# EAGLE design mycodo board 1.35 (EAGLE 9.6.2)
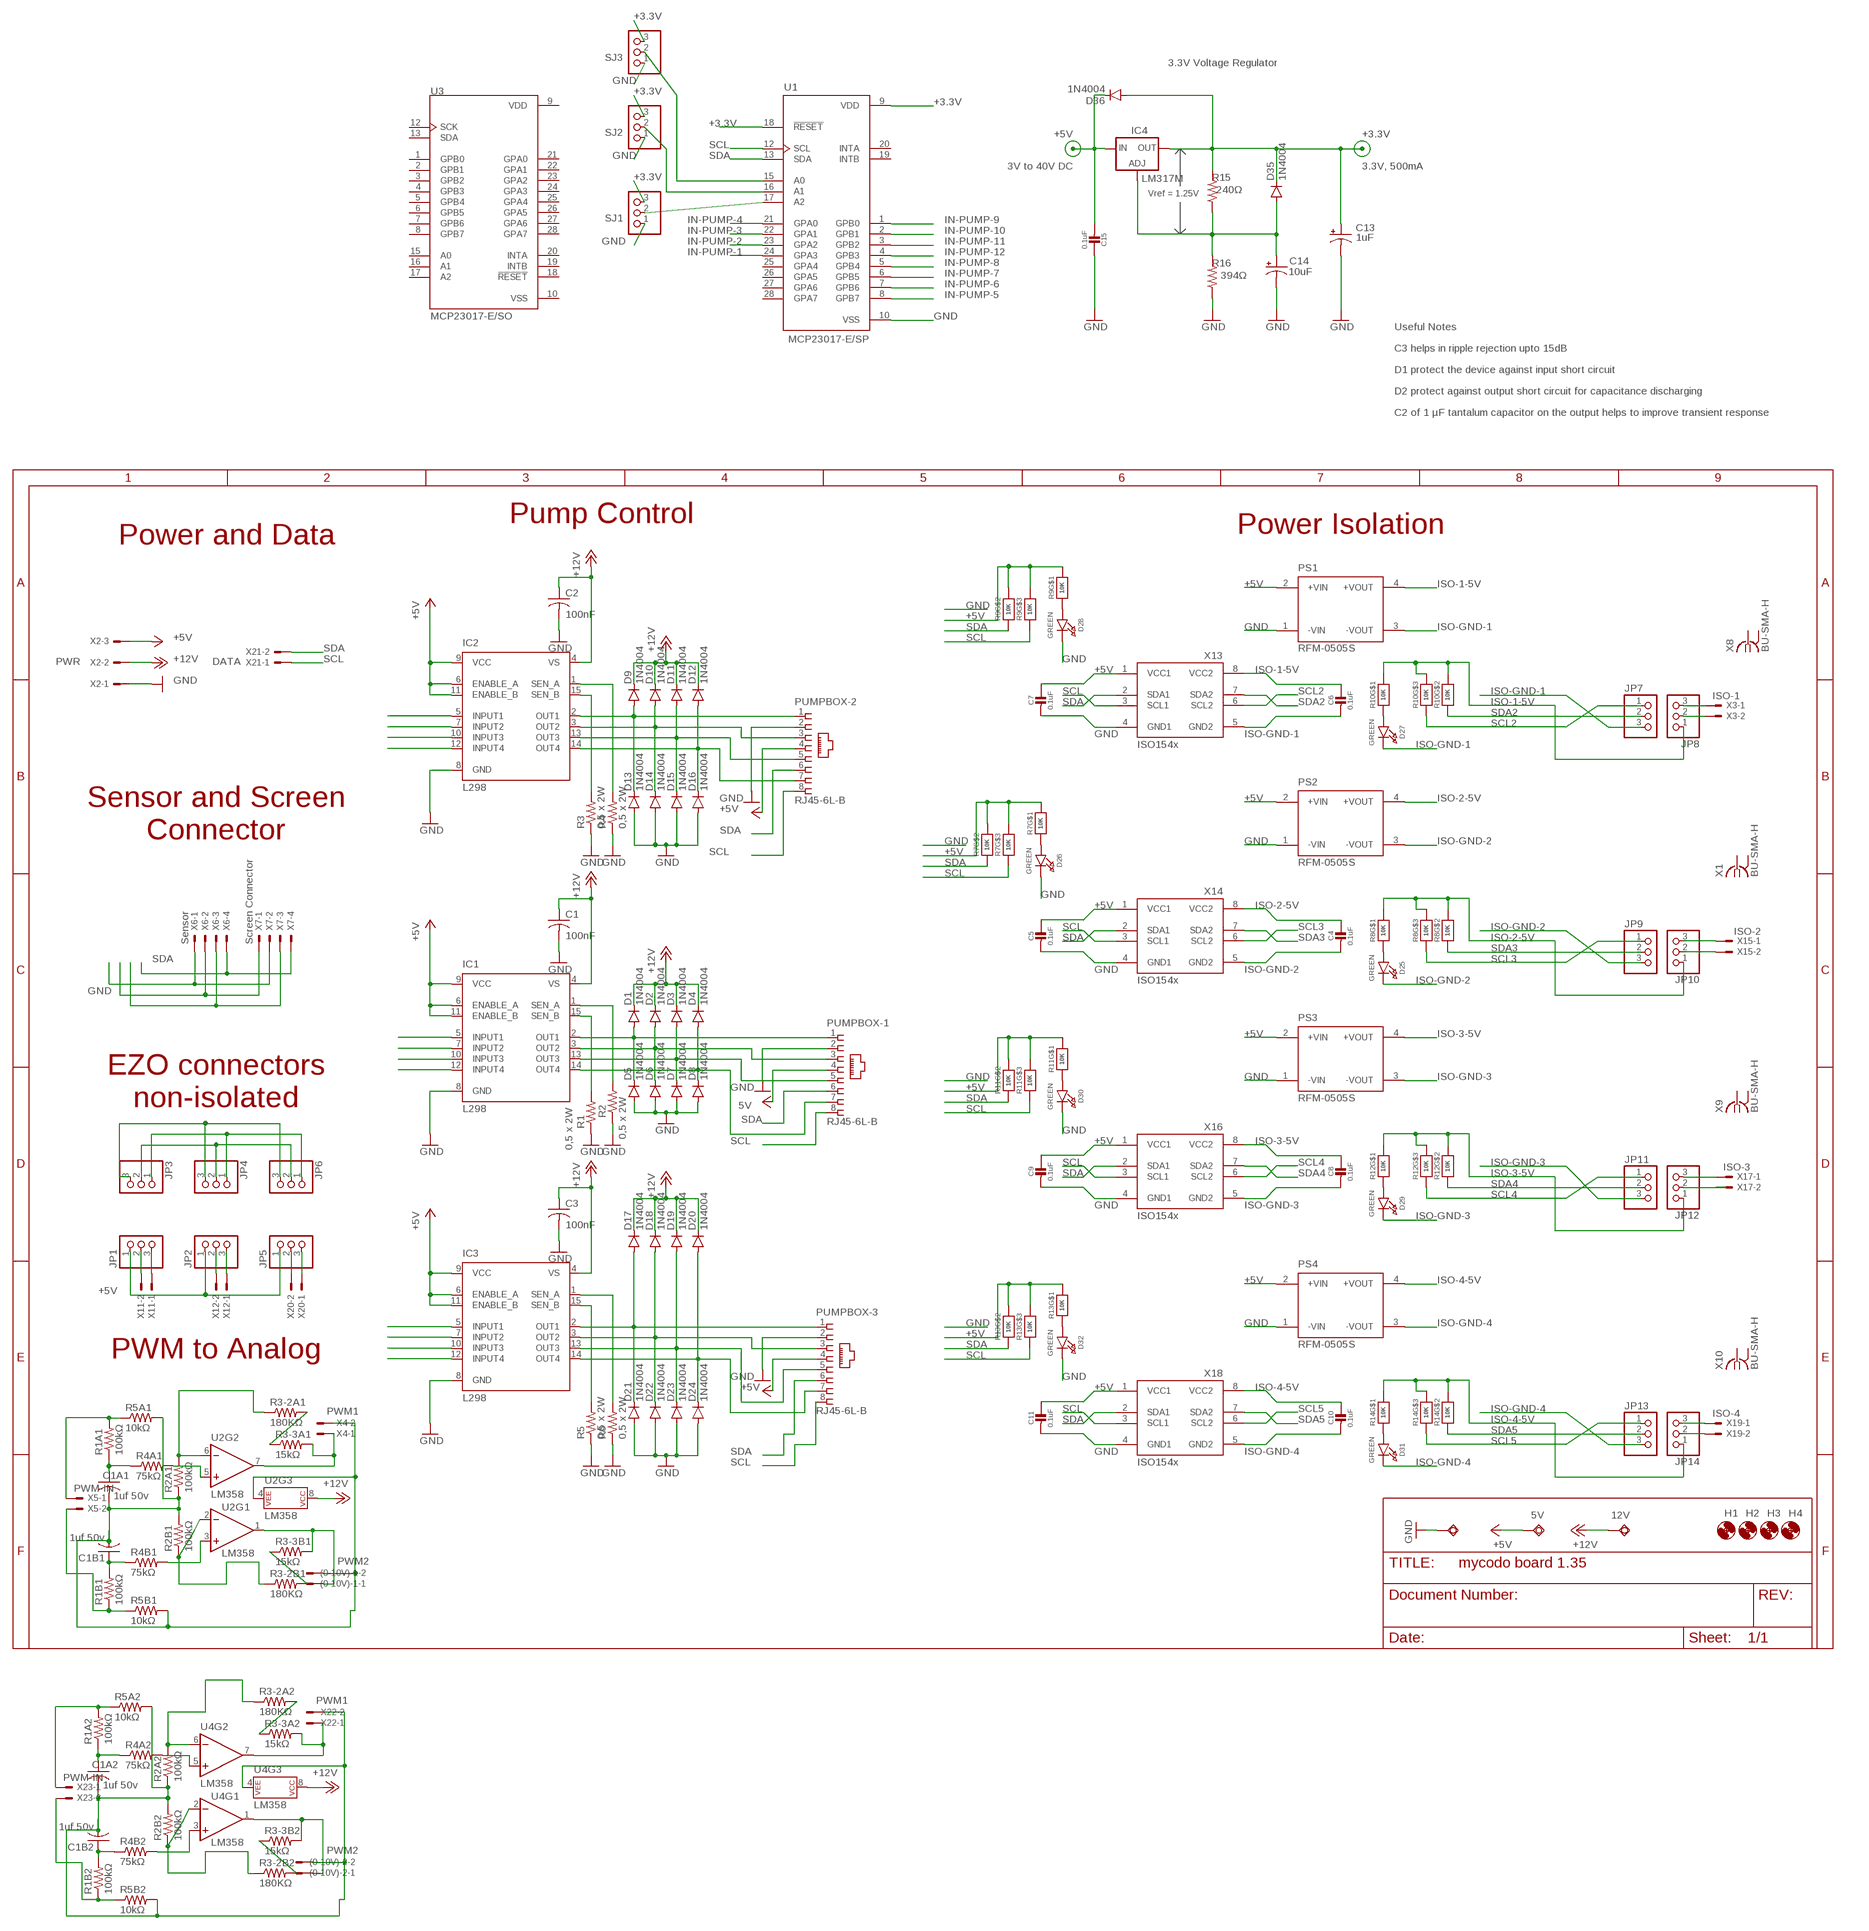
[diagram p0: schematic, sheet 1]

## Parts
5V  TPSQTP20SQ  [TP20SQ]
12V  TPSQTP20SQ  [TP20SQ]
(0-10V)-1  PWM2  JST-XH-02-PIN-LONG-PAD  [JST-XH-02-PACKAGE-LONG-PAD]
(0-10V)-2  PWM2  JST-XH-02-PIN-LONG-PAD  [JST-XH-02-PACKAGE-LONG-PAD]
C1  100nF  C-USC1206  [C1206]
C1A1  1uf 50v  C-USC1206  [C1206]
C1A2  1uf 50v  C-USC1206  [C1206]
C1B1  1uf 50v  C-USC1206  [C1206]
C1B2  1uf 50v  C-USC1206  [C1206]
C2  100nF  C-USC1206  [C1206]
C3  100nF  C-USC1206  [C1206]
C4  0.1uF  CAP_CERAMIC0603_NO  [0603-NO]
C5  0.1uF  CAP_CERAMIC0603_NO  [0603-NO]
C6  0.1uF  CAP_CERAMIC0603_NO  [0603-NO]
C7  0.1uF  CAP_CERAMIC0603_NO  [0603-NO]
C8  0.1uF  CAP_CERAMIC0603_NO  [0603-NO]
C9  0.1uF  CAP_CERAMIC0603_NO  [0603-NO]
C10  0.1uF  CAP_CERAMIC0603_NO  [0603-NO]
C11  0.1uF  CAP_CERAMIC0603_NO  [0603-NO]
C13  1uF  CPOL-US085CS-1AR  [085CS_1AR]
C14  10uF  CPOL-US085CS-1AR  [085CS_1AR]
C15  0.1uF  CAP_CERAMIC0603_NO  [0603-NO]
D1  1N4004  DIODE-DO214BA  [DO214BA]
D2  1N4004  DIODE-DO214BA  [DO214BA]
D3  1N4004  DIODE-DO214BA  [DO214BA]
D4  1N4004  DIODE-DO214BA  [DO214BA]
D5  1N4004  DIODE-DO214BA  [DO214BA]
D6  1N4004  DIODE-DO214BA  [DO214BA]
D7  1N4004  DIODE-DO214BA  [DO214BA]
D8  1N4004  DIODE-DO214BA  [DO214BA]
D9  1N4004  DIODE-DO214BA  [DO214BA]
D10  1N4004  DIODE-DO214BA  [DO214BA]
D11  1N4004  DIODE-DO214BA  [DO214BA]
D12  1N4004  DIODE-DO214BA  [DO214BA]
D13  1N4004  DIODE-DO214BA  [DO214BA]
D14  1N4004  DIODE-DO214BA  [DO214BA]
D15  1N4004  DIODE-DO214BA  [DO214BA]
D16  1N4004  DIODE-DO214BA  [DO214BA]
D17  1N4004  DIODE-DO214BA  [DO214BA]
D18  1N4004  DIODE-DO214BA  [DO214BA]
D19  1N4004  DIODE-DO214BA  [DO214BA]
D20  1N4004  DIODE-DO214BA  [DO214BA]
D21  1N4004  DIODE-DO214BA  [DO214BA]
D22  1N4004  DIODE-DO214BA  [DO214BA]
D23  1N4004  DIODE-DO214BA  [DO214BA]
D24  1N4004  DIODE-DO214BA  [DO214BA]
D25  GREEN  LED0603_NOOUTLINE  [CHIPLED_0603_NOOUTLINE]
D26  GREEN  LED0603_NOOUTLINE  [CHIPLED_0603_NOOUTLINE]
D27  GREEN  LED0603_NOOUTLINE  [CHIPLED_0603_NOOUTLINE]
D28  GREEN  LED0603_NOOUTLINE  [CHIPLED_0603_NOOUTLINE]
D29  GREEN  LED0603_NOOUTLINE  [CHIPLED_0603_NOOUTLINE]
D30  GREEN  LED0603_NOOUTLINE  [CHIPLED_0603_NOOUTLINE]
D31  GREEN  LED0603_NOOUTLINE  [CHIPLED_0603_NOOUTLINE]
D32  GREEN  LED0603_NOOUTLINE  [CHIPLED_0603_NOOUTLINE]
D35  1N4004  DIODE-DO214BA  [DO214BA]
D36  1N4004  DIODE-DO214BA  [DO214BA]
GND  TPSQTP20SQ  [TP20SQ]
H1  MOUNT-HOLE3.0  [3,0]
H2  MOUNT-HOLE3.0  [3,0]
H3  MOUNT-HOLE3.0  [3,0]
H4  MOUNT-HOLE3.0  [3,0]
IC1  L298  [MULTIWATT-15]
IC2  L298  [MULTIWATT-15]
IC3  L298  [MULTIWATT-15]
IC4  LM317MBSTT3  [SOT223]
JP1  PINHD-1X3CB  [1X03-CLEANBIG]
JP2  PINHD-1X3CB  [1X03-CLEANBIG]
JP3  PINHD-1X3CB  [1X03-CLEANBIG]
JP4  PINHD-1X3CB  [1X03-CLEANBIG]
JP5  PINHD-1X3CB  [1X03-CLEANBIG]
JP6  PINHD-1X3CB  [1X03-CLEANBIG]
JP7  PINHD-1X3CB  [1X03-CLEANBIG]
JP8  PINHD-1X3CB  [1X03-CLEANBIG]
JP9  PINHD-1X3CB  [1X03-CLEANBIG]
JP10  PINHD-1X3CB  [1X03-CLEANBIG]
JP11  PINHD-1X3CB  [1X03-CLEANBIG]
JP12  PINHD-1X3CB  [1X03-CLEANBIG]
JP13  PINHD-1X3CB  [1X03-CLEANBIG]
JP14  PINHD-1X3CB  [1X03-CLEANBIG]
PS1  RFM-0505S  [CONV_RFM-0505S]
PS2  RFM-0505S  [CONV_RFM-0505S]
PS3  RFM-0505S  [CONV_RFM-0505S]
PS4  RFM-0505S  [CONV_RFM-0505S]
PUMPBOX-1  RJ45-6L-B  [RJ45-NO-SHIELD]
PUMPBOX-2  RJ45-6L-B  [RJ45-NO-SHIELD]
PUMPBOX-3  RJ45-6L-B  [RJ45-NO-SHIELD]
R1  0,5 x 2W  R-US_R2512  [R2512]
R1A1  100kΩ  R-US_M1206  [M1206]
R1A2  100kΩ  R-US_M1206  [M1206]
R1B1  100kΩ  R-US_M1206  [M1206]
R1B2  100kΩ  R-US_M1206  [M1206]
R2  0,5 x 2W  R-US_R2512  [R2512]
R2A1  100kΩ  R-US_M1206  [M1206]
R2A2  100kΩ  R-US_M1206  [M1206]
R2B1  100kΩ  R-US_M1206  [M1206]
R2B2  100kΩ  R-US_M1206  [M1206]
R3  0,5 x 2W  R-US_R2512  [R2512]
R3-2A1  180KΩ  R-US_M1206  [M1206]
R3-2A2  180KΩ  R-US_M1206  [M1206]
R3-2B1  180KΩ  R-US_M1206  [M1206]
R3-2B2  180KΩ  R-US_M1206  [M1206]
R3-3A1  15kΩ  R-US_M1206  [M1206]
R3-3A2  15kΩ  R-US_M1206  [M1206]
R3-3B1  15kΩ  R-US_M1206  [M1206]
R3-3B2  15kΩ  R-US_M1206  [M1206]
R4  0,5 x 2W  R-US_R2512  [R2512]
R4A1  75kΩ  R-US_M1206  [M1206]
R4A2  75kΩ  R-US_M1206  [M1206]
R4B1  75kΩ  R-US_M1206  [M1206]
R4B2  75kΩ  R-US_M1206  [M1206]
R5  0,5 x 2W  R-US_R2512  [R2512]
R5A1  10kΩ  R-US_M1206  [M1206]
R5A2  10kΩ  R-US_M1206  [M1206]
R5B1  10kΩ  R-US_M1206  [M1206]
R5B2  10kΩ  R-US_M1206  [M1206]
R6  0,5 x 2W  R-US_R2512  [R2512]
R7  10K  RESISTOR_4PACK  [RESPACK_4X0603]
R8  10K  RESISTOR_4PACK  [RESPACK_4X0603]
R9  10K  RESISTOR_4PACK  [RESPACK_4X0603]
R10  10K  RESISTOR_4PACK  [RESPACK_4X0603]
R11  10K  RESISTOR_4PACK  [RESPACK_4X0603]
R12  10K  RESISTOR_4PACK  [RESPACK_4X0603]
R13  10K  RESISTOR_4PACK  [RESPACK_4X0603]
R14  10K  RESISTOR_4PACK  [RESPACK_4X0603]
R15  240Ω  R-US_M0805  [M0805]
R16  394Ω  R-US_M0805  [M0805]
SJ1  PINHD-1X3  [1X03]
SJ2  PINHD-1X3  [1X03]
SJ3  PINHD-1X3  [1X03]
U1  MCP23017-E/SP  [DIP787W45P254L3556H508Q28]
U2  LM358  [DIP08]
U3  MCP23017-E/SO  [SOIC127P1030X265-28N]
U4  LM358  [DIP08]
X1  BU-SMA-H  [BU-SMA-H]
X2  PWR  JST-XH-03-PIN-LONG-PAD  [JST-XH-03-PACKAGE-LONG-PAD]
X3  ISO-1  JST-XH-02-PIN-LONG-PAD  [JST-XH-02-PACKAGE-LONG-PAD]
X4  PWM1  JST-XH-02-PIN-LONG-PAD  [JST-XH-02-PACKAGE-LONG-PAD]
X5  PWM-IN  JST-XH-02-PIN-LONG-PAD  [JST-XH-02-PACKAGE-LONG-PAD]
X6  Sensor  JST-XH-04-PIN-LONG-PAD  [JST-XH-04-PACKAGE-LONG-PAD]
X7  Screen Connector  JST-XH-04-PIN-LONG-PAD  [JST-XH-04-PACKAGE-LONG-PAD]
X8  BU-SMA-H  [BU-SMA-H]
X9  BU-SMA-H  [BU-SMA-H]
X10  BU-SMA-H  [BU-SMA-H]
X11  rr  JST-XH-02-PIN-LONG-PAD  [JST-XH-02-PACKAGE-LONG-PAD]
X12  EZO2  JST-XH-02-PIN-LONG-PAD  [JST-XH-02-PACKAGE-LONG-PAD]
X13  ISO154X  [SOIC8_150MIL]
X14  ISO154X  [SOIC8_150MIL]
X15  ISO-2  JST-XH-02-PIN-LONG-PAD  [JST-XH-02-PACKAGE-LONG-PAD]
X16  ISO154X  [SOIC8_150MIL]
X17  ISO-3  JST-XH-02-PIN-LONG-PAD  [JST-XH-02-PACKAGE-LONG-PAD]
X18  ISO154X  [SOIC8_150MIL]
X19  ISO-4  JST-XH-02-PIN-LONG-PAD  [JST-XH-02-PACKAGE-LONG-PAD]
X20  NISO-3  JST-XH-02-PIN-LONG-PAD  [JST-XH-02-PACKAGE-LONG-PAD]
X21  DATA  JST-XH-02-PIN-LONG-PAD  [JST-XH-02-PACKAGE-LONG-PAD]
X22  PWM1  JST-XH-02-PIN-LONG-PAD  [JST-XH-02-PACKAGE-LONG-PAD]
X23  PWM-IN  JST-XH-02-PIN-LONG-PAD  [JST-XH-02-PACKAGE-LONG-PAD]

## Nets
+3.3V: C13.+ D35.C D36.A IC4.4(OUT) R15.2 SJ1.3 SJ2.3 SJ3.3 U1.9(VDD) U1.18(!RESET)
+5V: 5V.TP C5.1 C7.1 C9.1 C11.1 C15.2 D36.C IC1.6(ENABLE_A) IC1.9(VCC) IC1.11(ENABLE_B) IC2.6(ENABLE_A) IC2.9(VCC) IC2.11(ENABLE_B) IC3.6(ENABLE_A) IC3.9(VCC) IC3.11(ENABLE_B) IC4.3(IN) JP1.1 JP2.1 JP5.1 PS1.2(+VIN) PS2.2(+VIN) PS3.2(+VIN) PS4.2(+VIN) PUMPBOX-1.4 PUMPBOX-2.4 PUMPBOX-3.4 R7.6 R7.7 R7.8 R9.6 R9.7 R9.8 R11.6 R11.7 R11.8 R13.6 R13.7 R13.8 X2.3 X6.1 X7.2 X13.1(VCC1) X14.1(VCC1) X16.1(VCC1) X18.1(VCC1) ; supply symbol labelled +3V3
+12V: 12V.TP C1.1 C2.1 C3.1 D1.C D2.C D3.C D4.C D9.C D10.C D11.C D12.C D17.C D18.C D19.C D20.C IC1.4(VS) IC2.4(VS) IC3.4(VS) U2.8(P$V+) U4.8(P$V+) X2.2
GND: (0-10V)-1.2 C1.2 C1A1.2 C1B1.2 C2.2 C3.2 C5.2 C7.2 C9.2 C11.2 C13.- C14.- C15.1 D5.A D6.A D7.A D8.A D13.A D14.A D15.A D16.A D21.A D22.A D23.A D24.A D26.C D28.C D30.C D32.C GND.TP IC1.8(GND) IC2.8(GND) IC3.8(GND) JP3.3 JP4.3 JP6.3 PS1.1(-VIN) PS2.1(-VIN) PS3.1(-VIN) PS4.1(-VIN) PUMPBOX-1.2 PUMPBOX-2.2 PUMPBOX-3.2 R1.1 R2.1 R2A1.1 R2B1.2 R3.1 R4.1 R5.1 R5A1.2 R5B1.2 R6.1 R16.1 SJ1.1 SJ2.1 SJ3.1 U1.10(VSS) U2.4(P$V-) X2.1 X4.2 X6.2 X7.1 X13.4(GND1) X14.4(GND1) X16.4(GND1) X18.4(GND1)
GND1: (0-10V)-2.2 C1A2.2 C1B2.2 R2A2.1 R2B2.2 R5A2.2 R5B2.2 U4.4(P$V-) X22.2
IN-PUMP-1: IC1.5(INPUT1) U1.24(GPA3)
IN-PUMP-2: IC1.7(INPUT2) U1.23(GPA2)
IN-PUMP-3: IC1.10(INPUT3) U1.22(GPA1)
IN-PUMP-4: IC1.12(INPUT4) U1.21(GPA0)
IN-PUMP-5: IC2.5(INPUT1) U1.8(GPB7)
IN-PUMP-6: IC2.7(INPUT2) U1.7(GPB6)
IN-PUMP-7: IC2.10(INPUT3) U1.6(GPB5)
IN-PUMP-8: IC2.12(INPUT4) U1.5(GPB4)
IN-PUMP-9: IC3.5(INPUT1) U1.1(GPB0)
IN-PUMP-10: IC3.7(INPUT2) U1.2(GPB1)
IN-PUMP-11: IC3.10(INPUT3) U1.3(GPB2)
IN-PUMP-12: IC3.12(INPUT4) U1.4(GPB3)
IN-PWM-1: R1A1.2 R5A1.1 X5.1
IN-PWM-2: R1B1.1 R5B1.1 X5.2
IN-PWM-3: R1A2.2 R5A2.1 X23.1
IN-PWM-4: R1B2.1 R5B2.1 X23.2
ISO-1-5V: C6.1 JP8.1 PS1.4(+VOUT) R10.6 R10.7 R10.8 X13.8(VCC2)
ISO-2-5V: C4.1 JP10.1 PS2.4(+VOUT) R8.6 R8.7 R8.8 X14.8(VCC2)
ISO-3-5V: C8.1 JP12.1 PS3.4(+VOUT) R12.6 R12.7 R12.8 X16.8(VCC2)
ISO-4-5V: C10.1 JP14.1 PS4.4(+VOUT) R14.6 R14.7 R14.8 X18.8(VCC2)
ISO-GND-1: C6.2 D27.C JP7.3 PS1.3(-VOUT) X13.5(GND2)
ISO-GND-2: C4.2 D25.C JP9.3 PS2.3(-VOUT) X14.5(GND2)
ISO-GND-3: C8.2 D29.C JP11.3 PS3.3(-VOUT) X16.5(GND2)
ISO-GND-4: C10.2 D31.C JP13.3 PS4.3(-VOUT) X18.5(GND2)
N$1: IC2.1(SEN_A) R4.2
N$2: IC2.15(SEN_B) R3.2
N$3: IC3.1(SEN_A) R6.2
N$4: IC3.15(SEN_B) R5.2
N$5: C14.+ D35.A IC4.1(ADJ) R15.1 R16.2
N$6: SJ1.2 U1.17(A2)
N$7: SJ2.2 U1.16(A1)
N$8: SJ3.2 U1.15(A0)
N$9: IC1.1(SEN_A) R2.2
N$10: IC1.15(SEN_B) R1.2
N$11: R2B2.1 R3-2B2.1 U4.2(-IN)
N$12: R3-2B2.2 R3-3B2.1
N$13: R2A2.2 R3-2A2.1 U4.6(-IN)
N$14: R3-2A2.2 R3-3A2.1
N$15: JP8.3 X3.1
N$16: JP8.2 X3.2
N$18: R3-2B1.2 R3-3B1.1
N$19: R2A1.2 R3-2A1.1 U2.6(-IN)
N$20: R3-2A1.2 R3-3A1.1
N$21: C1A1.1 R1A1.1 R4A1.1
N$22: C1B1.1 R1B1.2 R4B1.1
N$24: R2B1.1 R3-2B1.1 U2.2(-IN)
N$25: R4A1.2 U2.5(+IN)
N$26: R4B1.2 U2.3(+IN)
N$27: D28.A R9.1
N$28: D27.A R10.1
N$29: D26.A R7.1
N$30: D25.A R8.1
N$31: JP10.3 X15.1
N$32: JP10.2 X15.2
N$33: D30.A R11.1
N$34: D29.A R12.1
N$35: JP12.3 X17.1
N$36: JP12.2 X17.2
N$37: D32.A R13.1
N$38: D31.A R14.1
N$39: JP14.3 X19.1
N$40: JP14.2 X19.2
N$41: JP5.3 X20.1
N$42: JP5.2 X20.2
N$43: JP2.2 X12.2
N$44: JP2.3 X12.1
N$45: JP1.2 X11.2
N$46: JP1.3 X11.1
N$47: C1A2.1 R1A2.1 R4A2.1
N$48: C1B2.1 R1B2.2 R4B2.1
N$51: R4A2.2 U4.5(+IN)
N$52: R4B2.2 U4.3(+IN)
OUT-PUMP-1 [Pump Out]: D1.A D5.C IC1.2(OUT1) PUMPBOX-1.1
OUT-PUMP-2 [Pump Out]: D2.A D6.C IC1.3(OUT2) PUMPBOX-1.3
OUT-PUMP-3 [Pump Out]: D3.A D7.C IC1.13(OUT3) PUMPBOX-1.5
OUT-PUMP-4 [Pump Out]: D4.A D8.C IC1.14(OUT4) PUMPBOX-1.7
OUT-PUMP-5 [Pump Out]: D9.A D13.C IC2.2(OUT1) PUMPBOX-2.1
OUT-PUMP-6 [Pump Out]: D10.A D14.C IC2.3(OUT2) PUMPBOX-2.3
OUT-PUMP-7 [Pump Out]: D11.A D15.C IC2.13(OUT3) PUMPBOX-2.5
OUT-PUMP-8 [Pump Out]: D12.A D16.C IC2.14(OUT4) PUMPBOX-2.7
OUT-PUMP-9 [Pump Out]: D17.A D21.C IC3.2(OUT1) PUMPBOX-3.1
OUT-PUMP-10 [Pump Out]: D18.A D22.C IC3.3(OUT2) PUMPBOX-3.3
OUT-PUMP-11 [Pump Out]: D19.A D23.C IC3.13(OUT3) PUMPBOX-3.5
OUT-PUMP-12: D20.A D24.C IC3.14(OUT4) PUMPBOX-3.7
OUTA: R3-3A1.2 U2.7(OUT) X4.1
OUTA1: R3-3A2.2 U4.7(OUT) X22.1
OUTB: (0-10V)-1.1 R3-3B1.2 U2.1(OUT)
OUTB1: (0-10V)-2.1 R3-3B2.2 U4.1(OUT)
SCL: JP3.1 JP4.1 JP6.1 PUMPBOX-1.8 PUMPBOX-2.8 PUMPBOX-3.8 R7.3 R9.3 R11.3 R13.3 U1.12(SCL) X6.3 X7.3 X13.3(SCL1) X14.3(SCL1) X16.3(SCL1) X18.3(SCL1) X21.1
SCL2: JP7.1 R10.3 X13.6(SCL2)
SCL3: JP9.1 R8.3 X14.6(SCL2)
SCL4: JP11.1 R12.3 X16.6(SCL2)
SCL5: JP13.1 R14.3 X18.6(SCL2)
SDA: JP3.2 JP4.2 JP6.2 PUMPBOX-1.6 PUMPBOX-2.6 PUMPBOX-3.6 R7.2 R9.2 R11.2 R13.2 U1.13(SDA) X6.4 X7.4 X13.2(SDA1) X14.2(SDA1) X16.2(SDA1) X18.2(SDA1) X21.2
SDA2: JP7.2 R10.2 X13.7(SDA2)
SDA3: JP9.2 R8.2 X14.7(SDA2)
SDA4: JP11.2 R12.2 X16.7(SDA2)
SDA5: JP13.2 R14.2 X18.7(SDA2)
Unconnected: R7.4 R7.5 R8.4 R8.5 R9.4 R9.5 R10.4 R10.5 R11.4 R11.5 R12.4 R12.5 R13.4 R13.5 R14.4 R14.5 U1.19(INTB) U1.20(INTA) U1.25(GPA4) U1.26(GPA5) U1.27(GPA6) U1.28(GPA7) U3.1(GPB0) U3.2(GPB1) U3.3(GPB2) U3.4(GPB3) U3.5(GPB4) U3.6(GPB5) U3.7(GPB6) U3.8(GPB7) U3.12(SCK) U3.13(SDA) U3.15(A0) U3.16(A1) U3.17(A2) U3.18(!RESET) U3.19(INTB) U3.20(INTA) U3.21(GPA0) U3.22(GPA1) U3.23(GPA2) U3.24(GPA3) U3.25(GPA4) U3.26(GPA5) U3.27(GPA6) U3.28(GPA7) X1.1 X1.2 X1.3 X1.4 X1.5 X8.1 X8.2 X8.3 X8.4 X8.5 X9.1 X9.2 X9.3 X9.4 X9.5 X10.1 X10.2 X10.3 X10.4 X10.5

## Notes on the sheet
- 3.3V Voltage Regulator
- 3V to 40V DC | 3.3V, 500mA
- Vref = 1.25V
- Useful Notes
- C3 helps in ripple rejection upto 15dB
- D1 protect the device against input short circuit
- D2 protect against output short circuit for capacitance discharging
- C2 of 1 µF tantalum capacitor on the output helps to improve transient response
- Pump Control
- Power Isolation
- Power and Data
- Sensor and Screen
  Connector
- EZO connectors
  non-isolated
- PWM to Analog

## Power pins joined to a net without a drawn wire
VDD: U3.9(VDD)
VSS: U3.10(VSS)

## Library data of the parts
5V 12V GND = testpad:TPSQ: Test pad
(0-10V)-1 (0-10V)-2 X3-X5 X11 X12 X15 X17 X19-X23 = Rembrandt Electronics - JST XH Connectors v1-0:JST-XH-02-PIN: JST XH Connector 2 Pin Wire to board connector. Pitch: 2,54 mm, (0.100") Number of pins: 2 Created by Rembrandt Electronics www.rembrandtelectronics.com
C1 C1A1 C1A2 C1B1 C1B2 C2 C3 = adafruit:C-US: CAPACITOR, American symbol
C4-C11 C15 = microbuilder:CAP_CERAMIC: Ceramic Capacitors For new designs, use the packages preceded by an '_' character since they are more reliable: The following footprints should be used on most boards: _0402 - Standard footprint for regular board layouts _0603 - Standard footprint for regular board layouts _0805 - Standard footprint for regular board layouts _1206 - Standard footprint for regular board layouts For extremely tight-pitch boards where space is at a premium, the following 'micro-pitch' footprints can be used (smaller pads, no silkscreen outline, etc.): _0402MP - Micro-pitch footprint for very dense/compact boards _0603MP - Micro-pitch footprint for very dense/compact boards _0805MP - Micro-pitch footprint for very dense/compact boards _1206MP - Micro-pitch footprint for very dense/compact boards
C13 C14 = resistor:CPOL-US: POLARIZED CAPACITOR, American symbol
D1-D24 D35 D36 = diode:DIODE-: DIODE
D25-D32 = microbuilder:LED: LED 0603 - 0603 Surface Mount Package 2mA: Green LED - Low Power (3.9mcd, 2ma, 1.7Vf) - Digikey: 475-2709-2-ND Orange LED - Low Power (9.8mcd, 2ma, 1.8Vf) - Digikey: 475-1194-2-ND Red LED - Low Power (5mcd, 2ma, 1.8Vf) - Digikey: 475-1195-2-ND Yellow LED - Low Power (7mcd, 2ma, 1.8Vf) - Digikey: 475-1196-2-ND 5mA: Blue LED - Low Power (17mcd, 5ma, 2.9Vf) - Digikey: LNJ937W8CRACT-ND 0805 - 0805 Surface Mount Package 2mA: Red LED (8.8mcd, 2mA, 1.8Vf, Clear) - Low Power [Digikey: 475-2510-1-ND] Green LED (5mcd, 2mA, 1.8Vf, Clear) - Low Power [Digikey: 475-2730-1-ND] Yellow LED (11.3mcd, 2mA, 1.8Vf, Clear) - Low Power [Digikey: 475-2555-1-ND] 20mA: Red LED (104mcd, 20mA, Diffused) - LS R976 [Digikey: 475-1278-6-ND] Red LED (12mcd, 20mA, 2.0Vf, Clear) - APT2012EC [Digikey: 754-1128-1-ND] Green LED (15mcd, 20mA, 2.2Vf, Clear) - APT2012GC [Digikey: 754-1131-1-ND] Orange LED (160mcd, 20mA, 2.1Vf, Clear) - APT2012SECK [Digikey: 754-1130-1-ND] 1206 - 1206 Surface Mount Package Green LED (26mcd, 20mA, Diffused) - LG N971 [Digikey: 475-1407-6-ND] Red LED (15mcd, 20mA, Diffused) - LH N974 [Digikey: 475-1416-6-ND] Cree - Cree High-Power Surface Mount LEDs XPEBWT-L1-0000-00D50 - White 111lm 350mA 2.9Vf 6200K 110° XTEAWT-00-0000-00000LEE3 - White 114lm 350mA 2.85Vf 5000K 115° Everlight - Everlight 45-21 Series Surface Mount LEDs 45-21/QK2C-B2832AC2CB2/2T - Warm White 2000mcd 20mA 3.25Vf 3050K 120° 45-21/LK2C-B38452C4CB2/2T - Nuetral White 2000mcd 20mA 3.25Vf 4150K 120° 45-21/LK2C-B50634C6CB2/2T - Cold White 2200mcd 20mA 3.25Vf 5650K 120° PLCC2 Reverse Mount LS T77K-J1L2-1-0-2-R18-Z - Red 11.25mcd 2mA 1.8Vf 630nm 120° LO T77K-L1M2-24-Z - Orange 19.6mcd 2mA 1.8Vf 606nm 120° LY T77K-K2M1-26-Z - Yellow 15.7mcd 2mA 1.8Vf 587nm 120°
H1-H4 = holes:MOUNT-HOLE: MOUNTING HOLE with drill center marker
IC1-IC3 = st-microelectronics:L298: DUAL FULL-BRIDGE DRIVER
IC4 = v-reg:LM317?*: 500 mA Adjustable Output Positive Voltage Regulator Source: http://www.onsemi.co.jp .. LM317M-D.PDF; PARTNUMBER: LM317M
JP1-JP14 SJ1-SJ3 = adafruit:PINHD-1X3: PIN HEADER
PS1-PS4 = RFM-0505S:RFM-0505S: DC/DC Converter, 1 Watt, SIP4, Single Output Check availability <https://pricing.snapeda.com/parts/RFM-0505S/Recom%20Power/view-part?ref=eda>; AVAILABILITY: In Stock; DESCRIPTION: 1W DC/DC-Converter 'ECONOLINE' SIP4 1kV unreg; MF: Recom Power; MP: RFM-0505S; PACKAGE: SIP-4 Recom Power; PRICE: None; PURCHASE-URL: https://pricing.snapeda.com/search/part/RFM-0505S/?ref=eda
PUMPBOX-1-PUMPBOX-3 = con-tycoelectronics:RJ45: CORCOM Modular RJ Jacks No Shield Source: www.tycoelectronics.com .. ENG_DS_1654001_1099_RJ_L_0507.pdf; MPN: RJ45-6L-B; OC_FARNELL: unknown; OC_NEWARK: 16R6090
R1 R1A1 R1A2 R1B1 R1B2 R2 R2A1 R2A2 R2B1 R2B2 R3 R3-2A1 R3-2A2 R3-2B1 R3-2B2 R3-3A1 R3-3A2 R3-3B1 R3-3B2 R4 R4A1 R4A2 R4B1 R4B2 R5 R5A1 R5A2 R5B1 R5B2 R6 = adafruit:R-US_: RESISTOR, American symbol
R7-R14 = microbuilder:RESISTOR_4PACK: Resistor Packs (4 resistors) 4 x 0603 10K 1/16W - Digikey: YC164J-10KCT-ND
R15 R16 = resistor:R-US_: RESISTOR, American symbol
U1 = MCP23017-E_SP:MCP23017-E/SP: MCP23017 Series 5.5 V 1.7 MHz SMT 16-Bit I2C I/O Expander - SPDIP-28 Check availability <https://pricing.snapeda.com/parts/MCP23017-E/SP/Microchip%20Technology/view-part?ref=eda>; AVAILABILITY: In Stock; DESCRIPTION: I/O Expander 16 I²C 1.7 MHz 28-SPDIP; MF: Microchip Technology; MP: MCP23017-E/SP; PACKAGE: DIP-28 Microchip; PRICE: None; PURCHASE-URL: https://pricing.snapeda.com/search/part/MCP23017-E/SP/?ref=eda
U2 U4 = SparkFun-IC-Amplifiers:LM358: LM358 Jellybean op-amp Datasheet <http://www.sparkfun.com/datasheets/Components/General/LM358.pdf> SparkFun Products Op-Amp (Thru-Hole) - LM358 <https://www.sparkfun.com/products/9456> (COM-09456); PROD_ID: IC-09172
U3 = MCP23017-E_SO:MCP23017-E/SO: MCP23017 Series 5.5 V 1.7 MHz SMT 16-Bit I2C I/O Expander - SOIC-28 Check availability <https://pricing.snapeda.com/parts/MCP23017-E/SO/Microchip/view-part?ref=eda>; AVAILABILITY: In Stock; DESCRIPTION: I/O Expander 16 I²C 1.7 MHz 28-SOIC; MF: Microchip; MP: MCP23017-E/SO; PACKAGE: SOIC-28 Microchip; PRICE: None; PURCHASE-URL: https://pricing.snapeda.com/search/part/MCP23017-E/SO/?ref=eda
X1 X8-X10 = con-coax:BU-SMA-H: FEMALE SMA CONNECTOR Radiall; OC_FARNELL: unknown; OC_NEWARK: unknown
X2 = Rembrandt Electronics - JST XH Connectors v1-0:JST-XH-03-PIN: JST XH Connector 2 Pin Wire to board connector. Pitch: 2,54 mm, (0.100") Number of pins: 3 Created by Rembrandt Electronics www.rembrandtelectronics.com
X6 X7 = Rembrandt Electronics - JST XH Connectors v1-0:JST-XH-04-PIN: JST XH Connector 2 Pin Wire to board connector. Pitch: 2,54 mm, (0.100") Number of pins: 4 Created by Rembrandt Electronics www.rembrandtelectronics.com
X13 X14 X16 X18 = adafruit_power:ISO154X

## Net classes
0 default: width 0.152 mm
1 Pump Out: width 0.381 mm

## Board
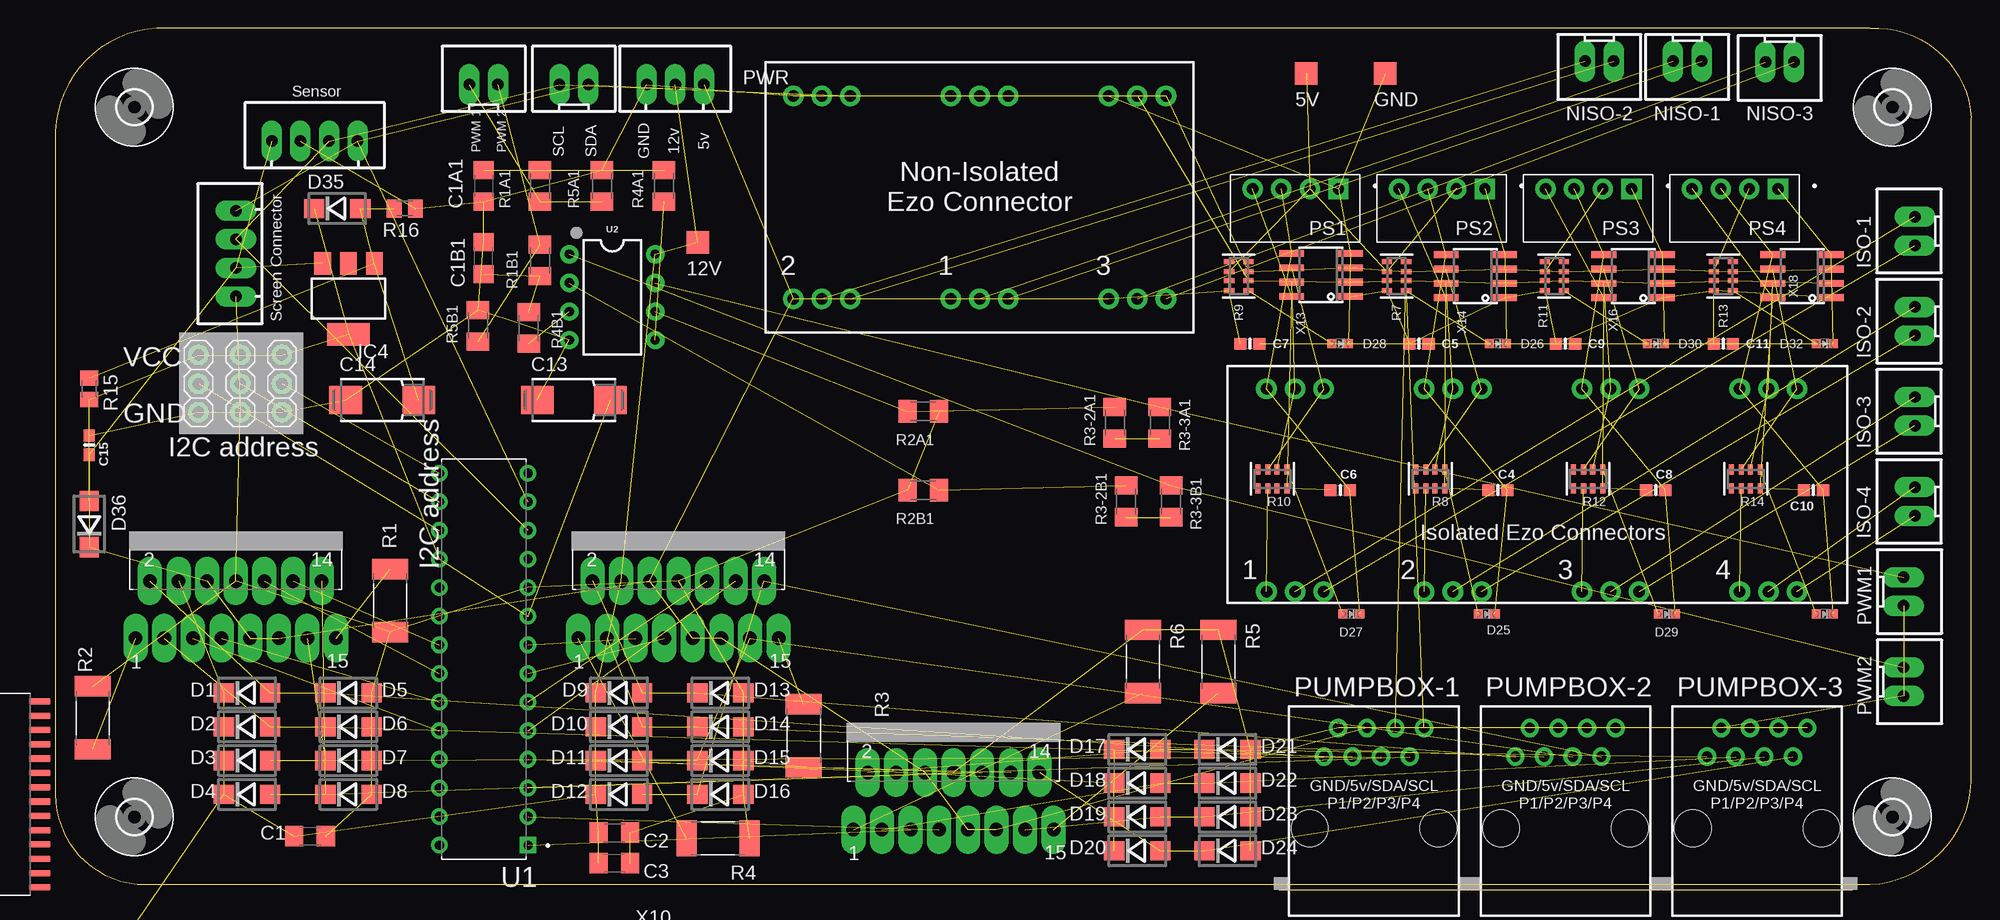
[diagram p1: board, top side]
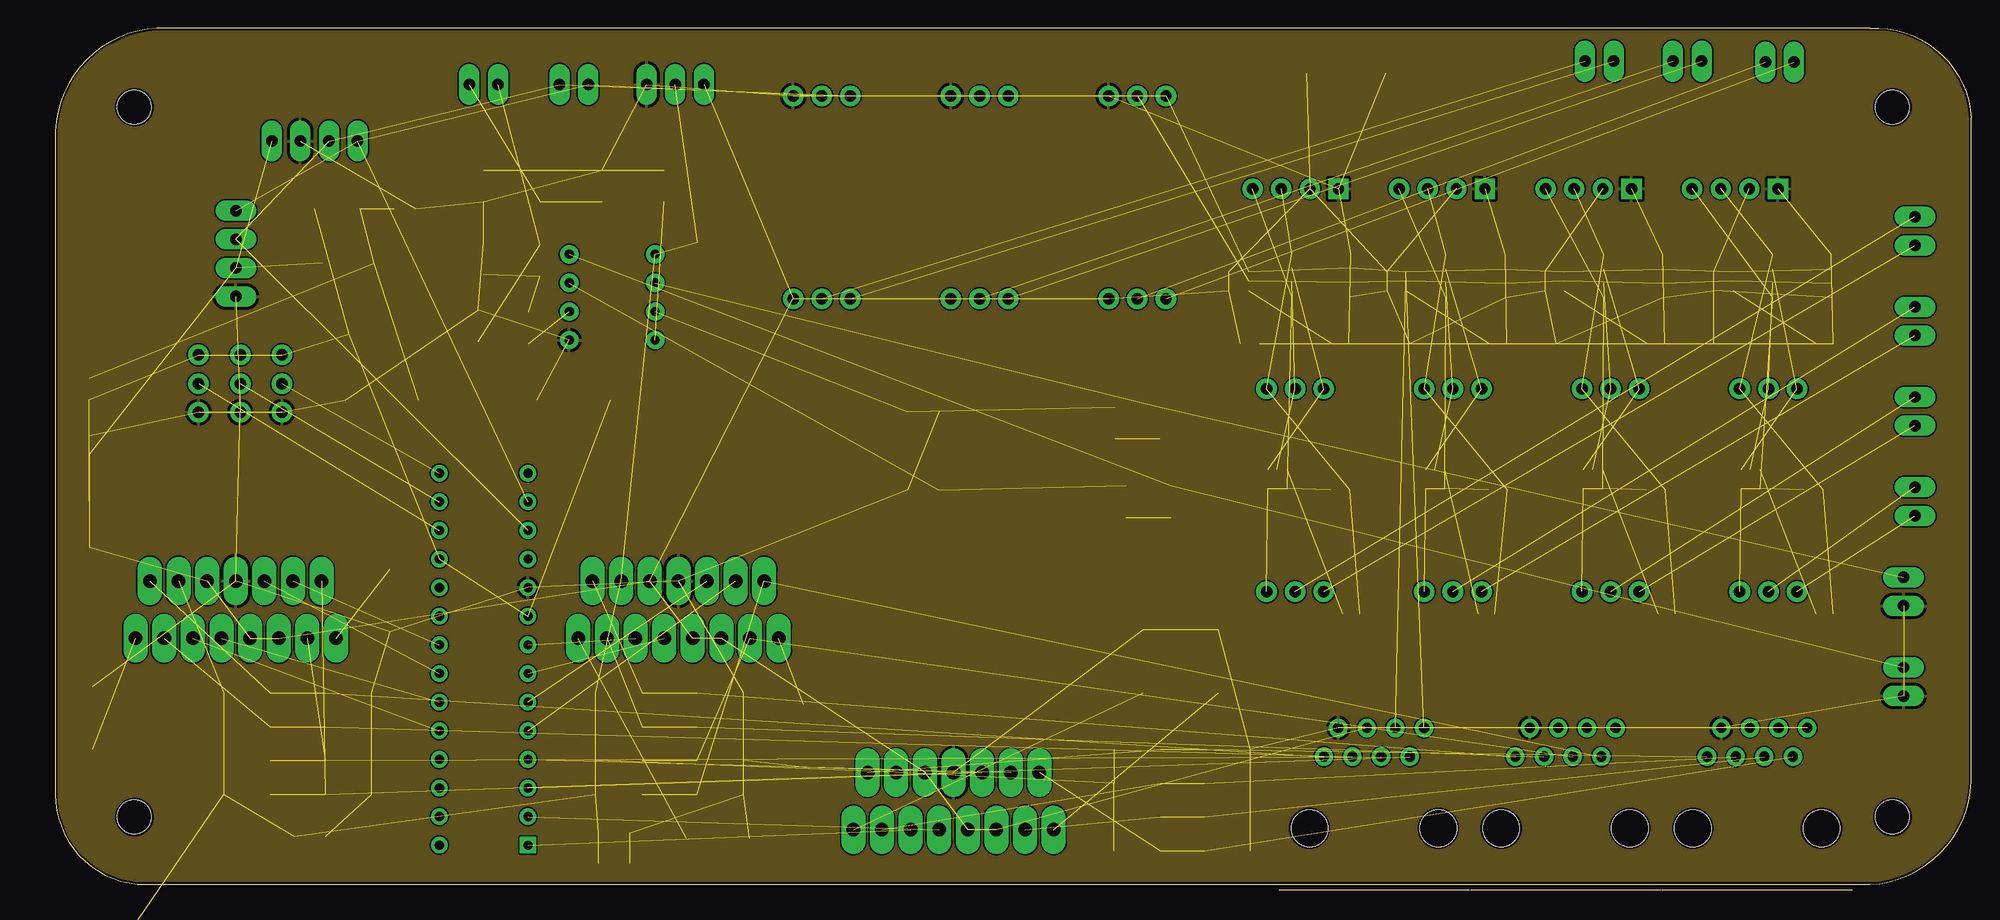
[diagram p2: board, inner layer Route2]
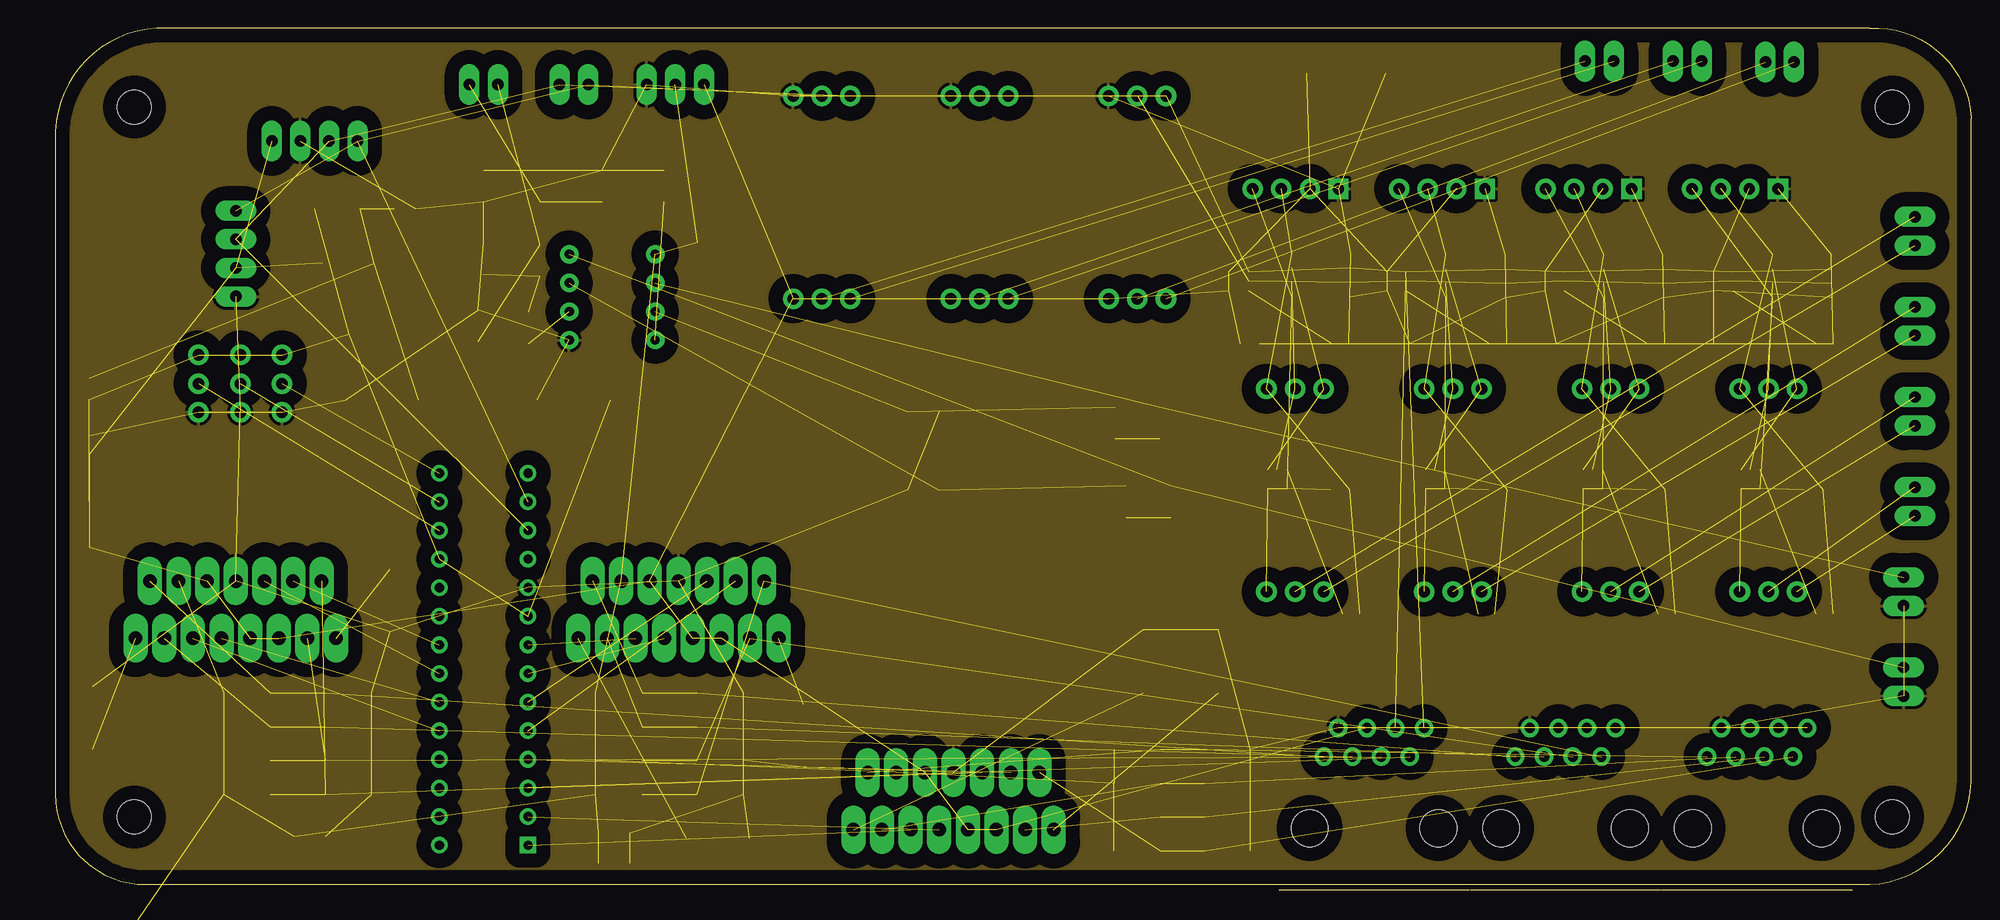
[diagram p3: board, inner layer Route15]
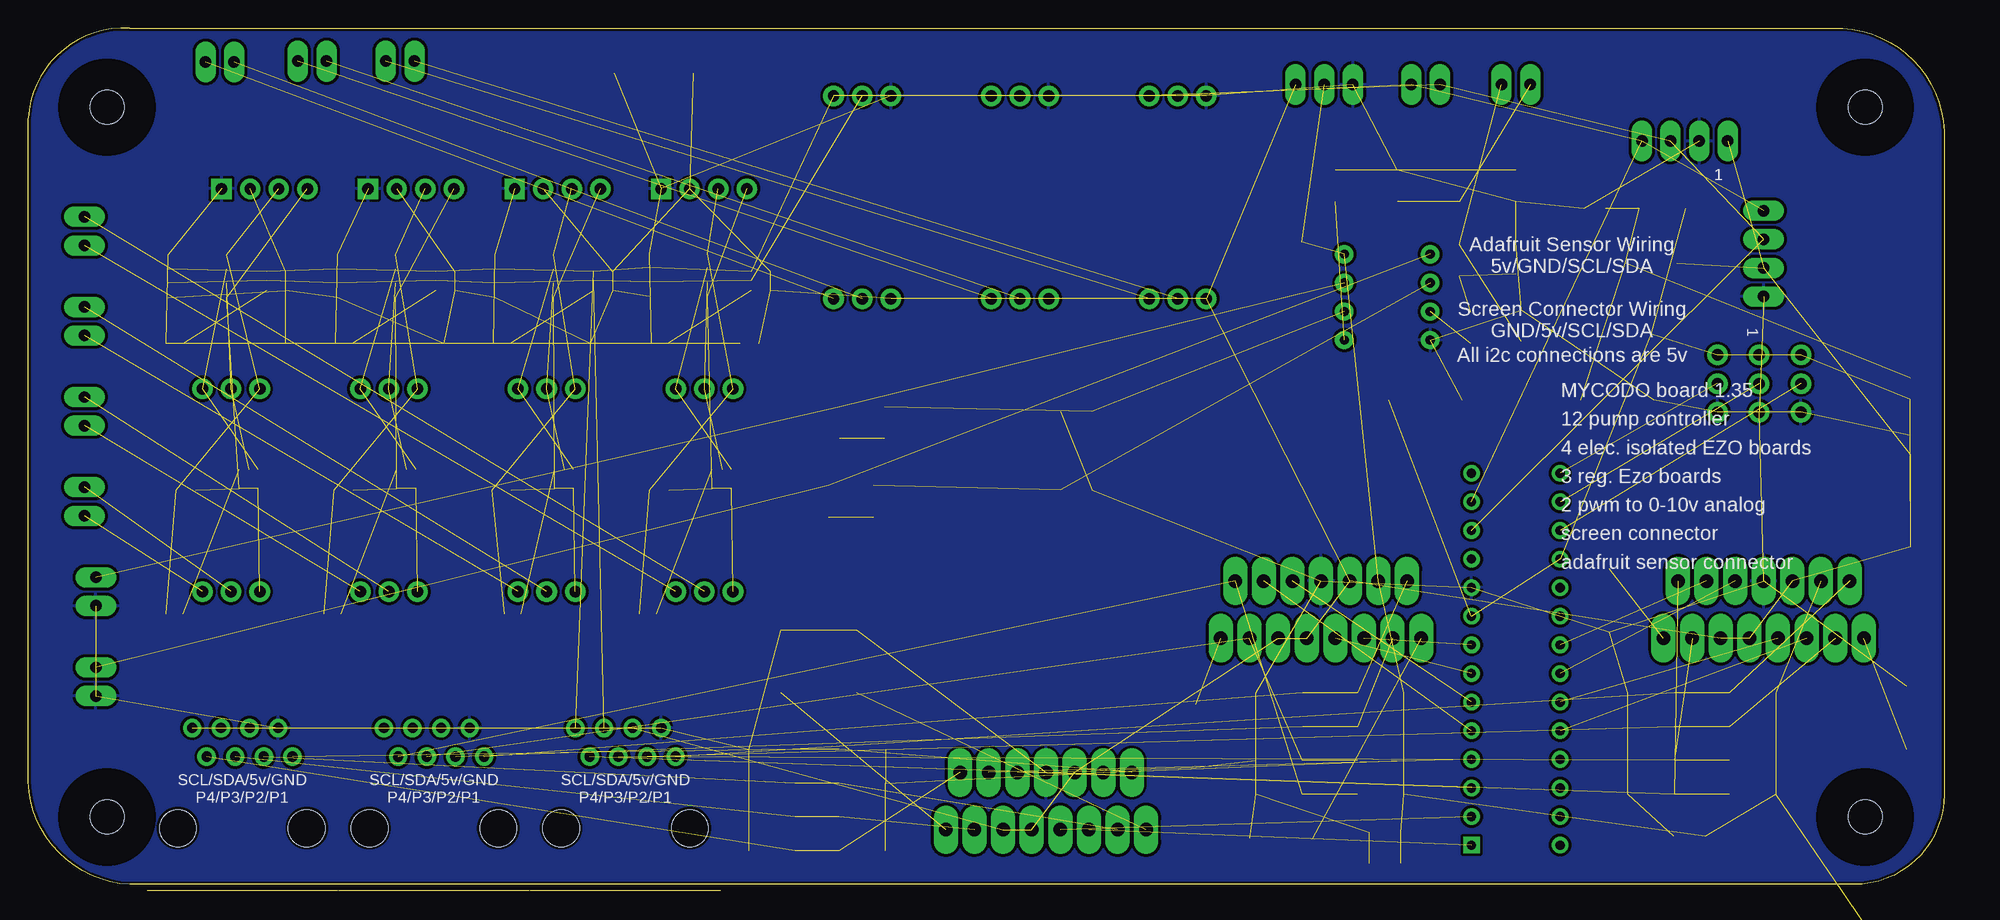
[diagram p4: board, bottom side, seen from below]

Size 170.01 x 76.01 mm. Coordinates in mm from the lower left corner, seen from the top.
Outline: 8.01,0 161.01,0 arc90 170.01,10 170.01,68 arc90 161.01,76 9.01,76 arc90 0.01,66 0.01,8 arc90 8.01,0
Copper layers (1+2*15+16): Top 0.035mm / dielectric 1.6mm / Route2 0.035mm / dielectric 0.15mm / Route15 0.035mm / dielectric 0.2mm / Bottom 0.035mm
Design rules "jlcpcb-2layers *": minimum track width 6mil, minimum drill 0.3mm, track to track 5mil, track to pad 5mil, pad to pad 5mil, via to via 5mil, smd to smd 5mil, copper to edge 0.2mm, drill to drill 6mil, minimum pad ring 10mil, minimum via ring 3mil, stop-mask expansion 4mil, vias tented up to drill 0mil, thermal gap 10mil

### Footprints (pad centres in the part's own frame; a part is rotated, then mirrored left to right if it is on the bottom)
TP20SQ = smd 2 x 2: TP 0,0
JST-XH-02-PACKAGE-LONG-PAD = drill 1.016 long: 1 -1.27,0; 2 1.27,0
C1206 = smd 1.6 x 1.8: 1 -1.4,0; 2 1.4,0
0603-NO = smd 1.075 x 1: 1 -0.85,0; 2 0.85,0
085CS_1AR = smd 2.9 x 2.5: + 3.25,0; - -3.25,0
DO214BA = smd 1.8 x 1.7: A 2.05,0; C -2.05,0
CHIPLED_0603_NOOUTLINE = smd 0.8 x 0.8: A 0,-0.75; C 0,0.75
3,0 = hole 3: 0,0
MULTIWATT-15 = drill 1.2 long: 1 -8.89,-7.62; 2 -7.62,-2.54; 3 -6.35,-7.62; 4 -5.08,-2.54; 5 -3.81,-7.62; 6 -2.54,-2.54; 7 -1.27,-7.62; 8 0,-2.54; 9 1.27,-7.62; 10 2.54,-2.54; 11 3.81,-7.62; 12 5.08,-2.54; 13 6.35,-7.62; 14 7.62,-2.54; 15 8.89,-7.62
SOT223 = smd 1.5 x 2: 1 -2.3,-3.15; 2 0,-3.15; 3 2.3,-3.15 | smd 3.8 x 2: 4 0,3.15
1X03-CLEANBIG = drill 1.016 pad 1.676: 1 -2.54,0; 2 0,0; 3 2.54,0
CONV_RFM-0505S = drill 1 square: 1 -3.85,-1.75 | drill 1: 2 -1.31,-1.75; 3 1.23,-1.75; 4 3.77,-1.75
RJ45-NO-SHIELD = drill 0.9 pad 1.4: 1 -4.445,6.35; 2 -3.175,8.89; 3 -1.905,6.35; 4 -0.635,8.89; 5 0.635,6.35; 6 1.905,8.89; 7 3.175,6.35; 8 4.445,8.89 | hole 3.251: -5.715,0; 5.715,0
R2512 = smd 1.8 x 3.2: 1 -2.8,0; 2 2.8,0
M1206 = smd 1.6 x 2: 1 -1.4,0; 2 1.4,0
RESPACK_4X0603 = smd 0.45 x 0.9: 1 -1.3,-0.85; 2 -0.4,-0.85; 3 0.4,-0.85; 4 1.3,-0.85; 5 1.3,0.85; 6 0.4,0.85; 7 -0.4,0.85; 8 -1.3,0.85
M0805 = smd 1.3 x 1.6: 1 -0.95,0; 2 0.95,0
1X03 = drill 1.016: 1 -2.54,0; 2 0,0; 3 2.54,0
DIP787W45P254L3556H508Q28 = drill 0.82 pad 1.23 square: 1 -3.935,16.51 | drill 0.82 pad 1.23: 2 -3.935,13.97; 3 -3.935,11.43; 4 -3.935,8.89; 5 -3.935,6.35; 6 -3.935,3.81; 7 -3.935,1.27; 8 -3.935,-1.27; 9 -3.935,-3.81; 10 -3.935,-6.35; 11 -3.935,-8.89; 12 -3.935,-11.43; 13 -3.935,-13.97; 14 -3.935,-16.51; 15 3.935,-16.51; 16 3.935,-13.97; 17 3.935,-11.43; 18 3.935,-8.89; 19 3.935,-6.35; 20 3.935,-3.81; 21 3.935,-1.27; 22 3.935,1.27; 23 3.935,3.81; 24 3.935,6.35; 25 3.935,8.89; 26 3.935,11.43; 27 3.935,13.97; 28 3.935,16.51
DIP08 = drill 0.813 pad 1.626: 1 -3.81,-3.81; 2 -1.27,-3.81; 3 1.27,-3.81; 4 3.81,-3.81; 5 3.81,3.81; 6 1.27,3.81; 7 -1.27,3.81; 8 -3.81,3.81
SOIC127P1030X265-28N = smd 1.9 x 0.6: 1 -4.605,8.255; 2 -4.605,6.985; 3 -4.605,5.715; 4 -4.605,4.445; 5 -4.605,3.175; 6 -4.605,1.905; 7 -4.605,0.635; 8 -4.605,-0.635; 9 -4.605,-1.905; 10 -4.605,-3.175; 11 -4.605,-4.445; 12 -4.605,-5.715; 13 -4.605,-6.985; 14 -4.605,-8.255; 15 4.605,-8.255; 16 4.605,-6.985; 17 4.605,-5.715; 18 4.605,-4.445; 19 4.605,-3.175; 20 4.605,-1.905; 21 4.605,-0.635; 22 4.605,0.635; 23 4.605,1.905; 24 4.605,3.175; 25 4.605,4.445; 26 4.605,5.715; 27 4.605,6.985; 28 4.605,8.255
BU-SMA-H = drill 1.27: 1 0,0 | drill 1.778: 2 -2.55,2.55; 3 2.55,2.55; 4 2.55,-2.55; 5 -2.55,-2.55
JST-XH-03-PACKAGE-LONG-PAD = drill 1.016 long: 1 -2.54,0; 2 0,0; 3 2.54,0
JST-XH-04-PACKAGE-LONG-PAD = drill 1.016 long: 1 -3.81,0; 2 -1.27,0; 3 1.27,0; 4 3.81,0
SOIC8_150MIL = smd 0.6 x 2.2: 1 -1.905,-2.6; 2 -0.635,-2.6; 3 0.635,-2.6; 4 1.905,-2.6; 5 1.905,2.6; 6 0.635,2.6; 7 -0.635,2.6; 8 -1.905,2.6

### Placement (x,y rotation side)
5V  111.01,72 0 top
12V  57.01,57 0 top
(0-10V)-1  164.01,18 270 top
(0-10V)-2  7.01,-33 0 top  (outside the outline)
C1  22.61,4.3 0 top
C1A1  38.01,62 270 top
C1A2  18.01,-56 0 top  (outside the outline)
C1B1  38.01,55.6 90 top
C1B2  -9.99,-63 0 top  (outside the outline)
C2  49.61,4.6 0 top
C3  49.61,1.9 0 top
C4  128.01,35 0 top
C5  121.01,48 0 top
C6  114.01,35 0 top
C7  106.01,48 0 top
C8  142.01,35 0 top
C9  134.01,48 0 top
C10  156.01,35 0 top
C11  148.01,48 0 top
C13  46.01,43 0 top
C14  29.01,43 0 top
C15  3.01,39 270 top
D1  17.01,17 0 top
D2  17.01,14 0 top
D3  17.01,11 0 top
D4  17.01,8 0 top
D5  26.01,17 0 top
D6  26.01,14 0 top
D7  26.01,11 0 top
D8  26.01,8 0 top
D9  50.01,17 0 top
D10  50.01,14 0 top
D11  50.01,11 0 top
D12  50.01,8 0 top
D13  59.01,17 0 top
D14  59.01,14 0 top
D15  59.01,11 0 top
D16  59.01,8 0 top
D17  96.01,12 0 top
D18  96.01,9 0 top
D19  96.01,6 0 top
D20  96.01,3 0 top
D21  104.01,12 0 top
D22  104.01,9 0 top
D23  104.01,6 0 top
D24  104.01,3 0 top
D25  127.01,24 270 top
D26  128.01,48 270 top
D27  115.01,24 270 top
D28  114.01,48 270 top
D29  143.01,24 270 top
D30  142.01,48 270 top
D31  157.01,24 270 top
D32  157.01,48 270 top
D35  25.01,60 0 top
D36  3.01,32 90 top
GND  118.01,72 0 top
H1  7.01,6 0 top
H2  163.01,6 0 top
H3  163.01,69 0 top
H4  7.01,69 0 top
IC1  16.01,29.48 0 top
IC2  55.29,29.48 0 top
IC3  79.7,12.48 0 top
IC4  26.01,52 180 top
JP1  68.01,52 0 top
JP2  82.01,52 0 top
JP3  68.01,70 180 top
JP4  82.01,70 180 top
JP5  96.01,52 0 top
JP6  96.01,70 180 top
JP7  110.01,44 180 top
JP8  110.01,26 0 top
JP9  124.01,44 180 top
JP10  124.01,26 0 top
JP11  138.01,44 180 top
JP12  138.01,26 0 top
JP13  152.01,44 180 top
JP14  152.01,26 0 top
PS1  110.01,60 180 top
PS2  123.01,60 180 top
PS3  136.01,60 180 top
PS4  149.01,60 180 top
PUMPBOX-1  117.01,5 0 top
PUMPBOX-2  134.01,5 0 top
PUMPBOX-3  151.01,5 0 top
R1  29.71,25.2 90 top
R1A1  43.01,62 270 top
R1A2  -1.99,-49 0 top  (outside the outline)
R1B1  43.01,55.4 270 top
R1B2  5.01,-49 0 top  (outside the outline)
R2  3.31,14.8 270 top
R2A1  77.01,42 180 top
R2A2  12.01,-49 0 top  (outside the outline)
R2B1  77.01,35 180 top
R2B2  19.01,-49 0 top  (outside the outline)
R3  66.41,13.2 90 top
R3-2A1  94.01,41 270 top
R3-2A2  1.01,-40 0 top  (outside the outline)
R3-2B1  95.01,34 270 top
R3-2B2  9.01,-40 0 top  (outside the outline)
R3-3A1  98.01,41 90 top
R3-3A2  17.01,-40 0 top  (outside the outline)
R3-3B1  99.01,34 90 top
R3-3B2  -9.99,-49 0 top  (outside the outline)
R4  58.81,4.1 180 top
R4A1  54.01,62 270 top
R4A2  -9.99,-56 0 top  (outside the outline)
R4B1  42.01,49.4 270 top
R4B2  -2.99,-56 0 top  (outside the outline)
R5  103.21,19.8 270 top
R5A1  48.51,62 90 top
R5A2  4.01,-56 0 top  (outside the outline)
R5B1  37.51,49.6 90 top
R5B2  11.01,-56 0 top  (outside the outline)
R6  96.51,19.8 270 top
R7  119.01,54 90 top
R8  122.01,36 180 top
R9  105.01,54 90 top
R10  108.01,36 180 top
R11  133.01,54 90 top
R12  136.01,36 180 top
R13  148.01,54 90 top
R14  150.01,36 180 top
R15  3.01,44 270 top
R16  31.01,60 180 top
SJ1  12.71,44.46 90 top
SJ2  16.41,44.46 90 top
SJ3  20.11,44.46 90 top
U1  38.01,20 180 top
U2  49.42,52.13 270 top
U3  -5.99,8 0 top
U4  -5.99,-32 0 top  (outside the outline)
X1  0.01,-10 0 top  (outside the outline)
X2  55.01,71 0 top
X3  165.01,58 90 top
X4  164.01,26 270 top
X5  38.01,71 0 top
X6  23.01,66 0 top
X7  16.01,56 90 top
X8  18.01,-10 0 top  (outside the outline)
X9  36.01,-9 0 top  (outside the outline)
X10  54.01,-8 0 top  (outside the outline)
X11  137.01,73.08 180 top
X12  144.81,73.08 180 top
X13  112.31,54.11 90 top
X14  126.01,54 90 top
X15  165.01,50 90 top
X16  140.01,54 90 top
X17  165.01,42 90 top
X18  155.01,54 90 top
X19  165.01,34 90 top
X20  153.01,73 180 top
X21  46.01,71 0 top
X22  17.01,-33 0 top  (outside the outline)
X23  -5.99,-43 0 top  (outside the outline)

### Tracks (layer width: path | path; a pad name or v marks a point on that pad's centre or on a via)
+3.3V  (9 unrouted)
+5V  (45 unrouted)
+12V  (21 unrouted)
GND  (66 unrouted)
  pour Bottom (isolate 0.254): 0.01,0 170.01,0 170.01,42 170.01,76 72.01,76 0.01,76
  pour Route2: 0.01,0 170.01,0 170.01,76 0.01,76
  pour Route15 (isolate 1.27): 0.01,0 116.01,0 170.01,0 170.01,43 170.01,76 63.01,76 0.01,76
GND1  (8 unrouted)
IN-PUMP-1  (1 unrouted)
IN-PUMP-2  (1 unrouted)
IN-PUMP-3  (1 unrouted)
IN-PUMP-4  (1 unrouted)
IN-PUMP-5  (1 unrouted)
IN-PUMP-6  (1 unrouted)
IN-PUMP-7  (1 unrouted)
IN-PUMP-8  (1 unrouted)
IN-PUMP-9  (1 unrouted)
IN-PUMP-10  (1 unrouted)
IN-PUMP-11  (1 unrouted)
IN-PUMP-12  (1 unrouted)
IN-PWM-1  (2 unrouted)
IN-PWM-2  (2 unrouted)
IN-PWM-3  (2 unrouted)
IN-PWM-4  (2 unrouted)
ISO-1-5V  (6 unrouted)
ISO-2-5V  (6 unrouted)
ISO-3-5V  (6 unrouted)
ISO-4-5V  (6 unrouted)
ISO-GND-1  (4 unrouted)
ISO-GND-2  (4 unrouted)
ISO-GND-3  (4 unrouted)
ISO-GND-4  (4 unrouted)
N$1  (1 unrouted)
N$2  (1 unrouted)
N$3  (1 unrouted)
N$4  (1 unrouted)
N$5  (4 unrouted)
N$6  (1 unrouted)
N$7  (1 unrouted)
N$8  (1 unrouted)
N$9  (1 unrouted)
N$10  (1 unrouted)
N$11  (2 unrouted)
N$12  (1 unrouted)
N$13  (2 unrouted)
N$14  (1 unrouted)
N$15  (1 unrouted)
N$16  (1 unrouted)
N$18  (1 unrouted)
N$19  (2 unrouted)
N$20  (1 unrouted)
N$21  (2 unrouted)
N$22  (2 unrouted)
N$24  (2 unrouted)
N$25  (1 unrouted)
N$26  (1 unrouted)
N$27  (1 unrouted)
N$28  (1 unrouted)
N$29  (1 unrouted)
N$30  (1 unrouted)
N$31  (1 unrouted)
N$32  (1 unrouted)
N$33  (1 unrouted)
N$34  (1 unrouted)
N$35  (1 unrouted)
N$36  (1 unrouted)
N$37  (1 unrouted)
N$38  (1 unrouted)
N$39  (1 unrouted)
N$40  (1 unrouted)
N$41  (1 unrouted)
N$42  (1 unrouted)
N$43  (1 unrouted)
N$44  (1 unrouted)
N$45  (1 unrouted)
N$46  (1 unrouted)
N$47  (2 unrouted)
N$48  (2 unrouted)
N$51  (1 unrouted)
N$52  (1 unrouted)
OUT-PUMP-1  (3 unrouted)
OUT-PUMP-2  (3 unrouted)
OUT-PUMP-3  (3 unrouted)
OUT-PUMP-4  (3 unrouted)
OUT-PUMP-5  (3 unrouted)
OUT-PUMP-6  (3 unrouted)
OUT-PUMP-7  (3 unrouted)
OUT-PUMP-8  (3 unrouted)
OUT-PUMP-9  (3 unrouted)
OUT-PUMP-10  (3 unrouted)
OUT-PUMP-11  (3 unrouted)
OUT-PUMP-12  (3 unrouted)
OUTA  (2 unrouted)
OUTA1  (2 unrouted)
OUTB  (2 unrouted)
OUTB1  (2 unrouted)
SCL  (17 unrouted)
SCL2  (2 unrouted)
SCL3  (2 unrouted)
SCL4  (2 unrouted)
SCL5  (2 unrouted)
SDA  (17 unrouted)
SDA2  (2 unrouted)
SDA3  (2 unrouted)
SDA4  (2 unrouted)
SDA5  (2 unrouted)

### Text on the board
tPlace: ⏚ | ⏚ | ⏚ | ⏚ | ⏚ | ⏚ | ⏚ | ⏚ | NISO-3 | ⏚ | SCL / SDA | GND / 12v / 5v | PWM 1 / PWM 2 | ⏚ | ⏚ | ⏚ | ⏚ | Non-Isolated / Ezo Connector | 2 | 1 | 3 | ⏚ | ⏚ | ⏚ | ⏚ | VCC | ⏚ | ⏚ | ⏚ | ⏚ | GND | ⏚ | I2C address | Isolated Ezo Connectors | ⏚ | I2C address | 1 | 2 | 3 | 4 | ⏚ | ⏚ | ⏚ | ⏚ | ⏚ | GND/5v/SDA/SCL / P1/P2/P3/P4 | GND/5v/SDA/SCL / P1/P2/P3/P4 | GND/5v/SDA/SCL / P1/P2/P3/P4
bPlace: ⏚ | ⏚ | ⏚ | ⏚ | ⏚ | 1 | ⏚ | ⏚ | ⏚ | ⏚ | Adafruit Sensor Wiring / 5v/GND/SCL/SDA / / Screen Connector Wiring / GND/5v/SCL/SDA | ⏚ | 1 | ⏚ | All i2c connections are 5v | MYCODO board 1.35 / 12 pump controller / 4 elec. isolated EZO boards / 3 reg. Ezo boards / 2 pwm to 0-10v analog / screen connector / adafruit sensor connector | ⏚ | ⏚ | ⏚ | SCL/SDA/5v/GND / P4/P3/P2/P1 | SCL/SDA/5v/GND / P4/P3/P2/P1 | SCL/SDA/5v/GND / P4/P3/P2/P1